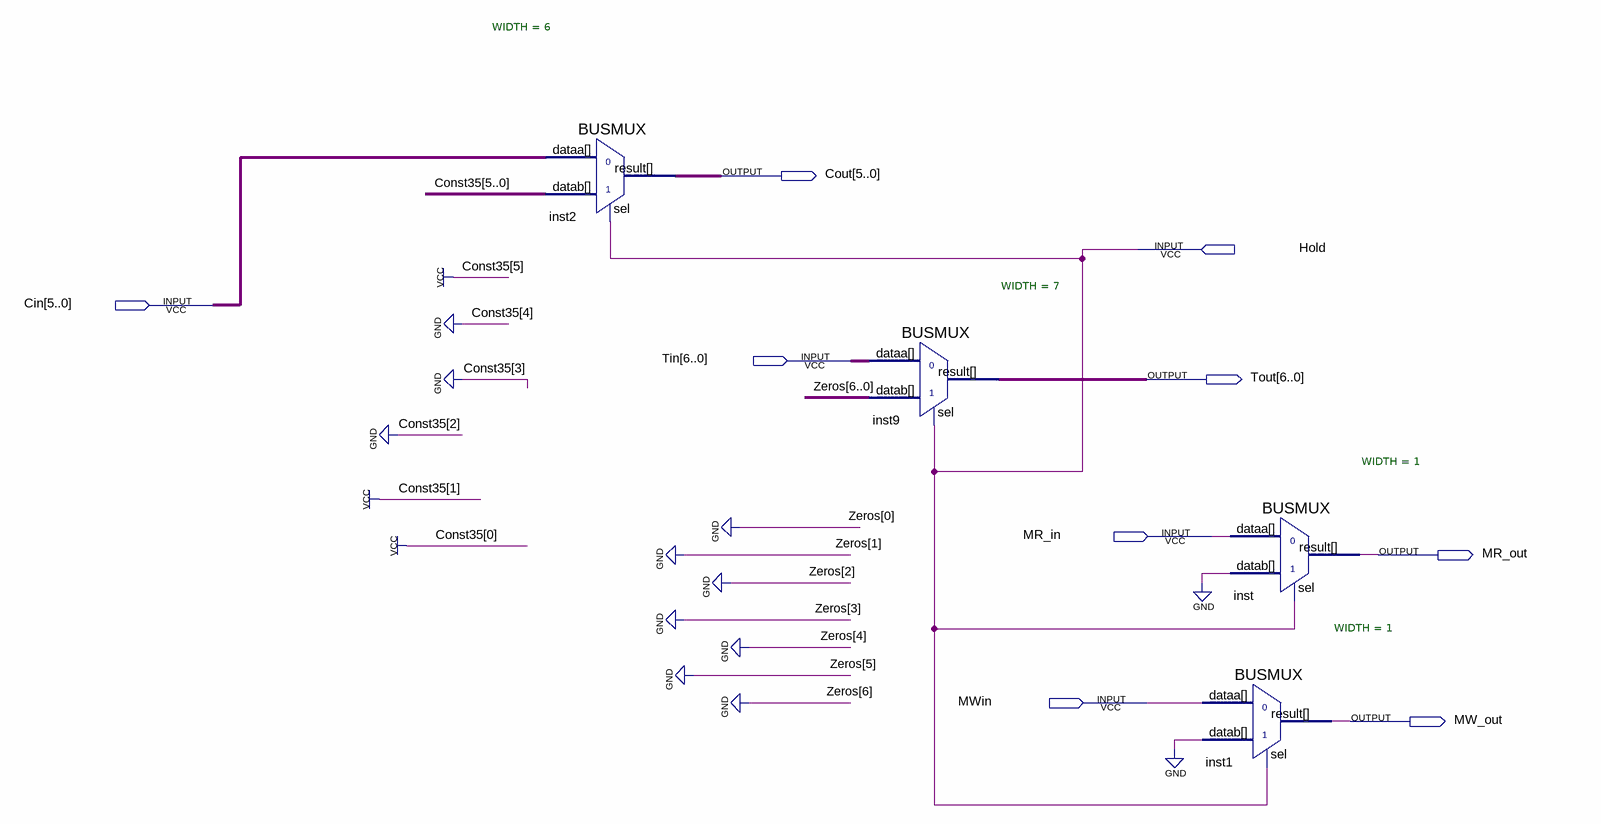
[diagram p0: schematic sheet]
// Quartus schematic FlushUnit.bdf as structural Verilog: 4 symbols, 9 pins
module FlushUnit (
  input  Hold,
  input  [5:0] Cin,
  input  [6:0] Tin,
  input  MR_in,
  input  MWin,
  output [5:0] Cout,
  output [6:0] Tout,
  output MR_out,
  output MW_out
);

  BUSMUX #(.WIDTH(6)) inst2 (.datab(6'b100011), .sel(Hold), .dataa(Cin), .result(Cout));
  BUSMUX #(.WIDTH(7)) inst9 (.datab({7{1'b0}}), .sel(Hold), .dataa(Tin), .result(Tout));
  BUSMUX #(.WIDTH(1)) inst (.datab(1'b0), .sel(Hold), .dataa(MR_in), .result(MR_out));
  BUSMUX #(.WIDTH(1)) inst1 (.datab(1'b0), .sel(Hold), .dataa(MWin), .result(MW_out));
endmodule
